# EAGLE design adp28 (EAGLE 6.2)
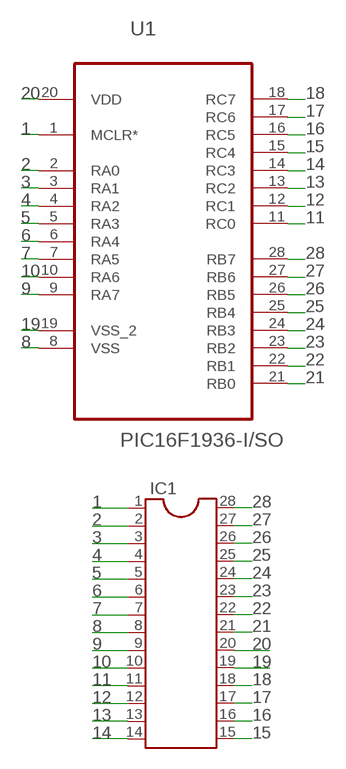
[diagram p0: schematic, sheet 1]

## Parts
IC1  DIL28  [DIL28-6]
U1  PIC16F1936-I/SO  [SOIC127P1030X265-28N]

## Nets
1: IC1.1 U1.1(MCLR*)
2: IC1.2 U1.2(RA0)
3: IC1.3 U1.3(RA1)
4: IC1.4 U1.4(RA2)
5: IC1.5 U1.5(RA3)
6: IC1.6 U1.6(RA4)
7: IC1.7 U1.7(RA5)
8: IC1.8 U1.8(VSS)
9: IC1.9 U1.9(RA7)
10: IC1.10 U1.10(RA6)
11: IC1.11 U1.11(RC0)
12: IC1.12 U1.12(RC1)
13: IC1.13 U1.13(RC2)
14: IC1.14 U1.14(RC3)
15: IC1.15 U1.15(RC4)
16: IC1.16 U1.16(RC5)
17: IC1.17 U1.17(RC6)
18: IC1.18 U1.18(RC7)
19: IC1.19 U1.19(VSS_2)
20: IC1.20 U1.20(VDD)
21: IC1.21 U1.21(RB0)
22: IC1.22 U1.22(RB1)
23: IC1.23 U1.23(RB2)
24: IC1.24 U1.24(RB3)
25: IC1.25 U1.25(RB4)
26: IC1.26 U1.26(RB5)
27: IC1.27 U1.27(RB6)
28: IC1.28 U1.28(RB7)

## Library data of the parts
IC1 = ic-package:DIL28: Dual In Line
U1 = pic16f1936 soic:PIC16F1936-I/SO: IC PIC MCU FLASH 512KX14 ,SOIC-28; MPN: PIC16F1936-I/SO; OC_FARNELL: 1755820; OC_NEWARK: 45P4764; PACKAGE: SOIC-28; SUPPLIER: Microchip

## Board
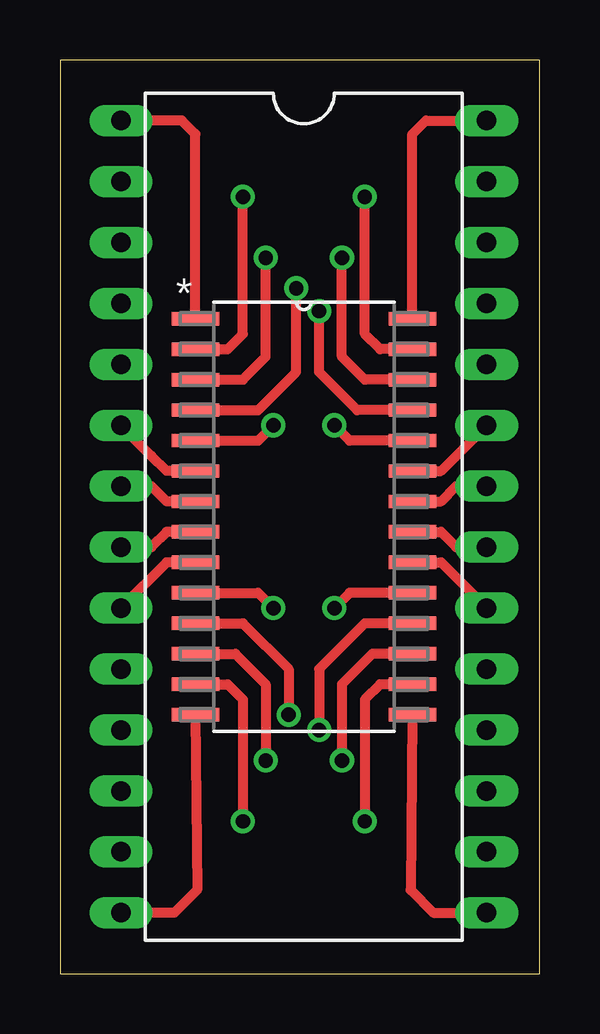
[diagram p1: board, top side]
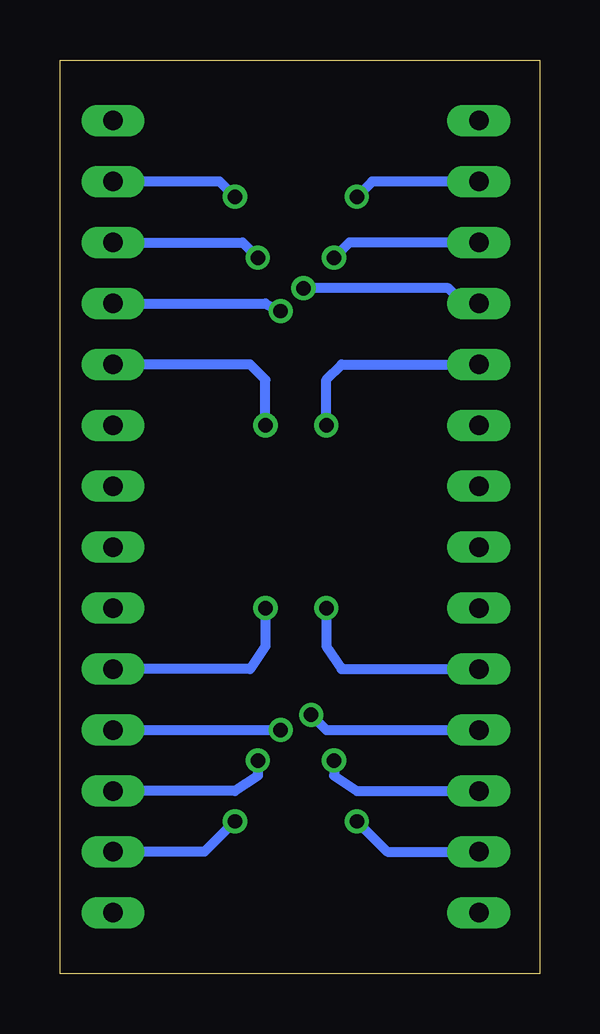
[diagram p2: board, bottom side, seen from below]

Size 19.99 x 38.09 mm. Coordinates in mm from the lower left corner, seen from the top.
Outline: 0,0 19.99,0 19.99,38.09 0,38.09 0,0
Copper layers (1*16): Top 0.035mm / dielectric 1.5mm / Bottom 0mil
Design rules: minimum track width 10mil, minimum drill 24mil, track to track 8mil, track to pad 8mil, pad to pad 8mil, via to via 8mil, smd to smd 8mil, copper to edge 40mil, drill to drill 8mil, minimum pad ring 10mil, minimum via ring 8mil, stop-mask expansion 4mil, vias tented up to drill 0mil, thermal gap 10mil

### Footprints (pad centres in the part's own frame; a part is rotated, then mirrored left to right if it is on the bottom)
DIL28-6 = drill 0.813 long: 1 -16.51,-7.62; 2 -13.97,-7.62; 3 -11.43,-7.62; 4 -8.89,-7.62; 5 -6.35,-7.62; 6 -3.81,-7.62; 7 -1.27,-7.62; 8 1.27,-7.62; 9 3.81,-7.62; 10 6.35,-7.62; 11 8.89,-7.62; 12 11.43,-7.62; 13 13.97,-7.62; 14 16.51,-7.62; 15 16.51,7.62; 16 13.97,7.62; 17 11.43,7.62; 18 8.89,7.62; 19 6.35,7.62; 20 3.81,7.62; 21 1.27,7.62; 22 -1.27,7.62; 23 -3.81,7.62; 24 -6.35,7.62; 25 -8.89,7.62; 26 -11.43,7.62; 27 -13.97,7.62; 28 -16.51,7.62
SOIC127P1030X265-28N = smd 1.981 x 0.559: 1 -4.521,8.255; 2 -4.521,6.985; 3 -4.521,5.715; 4 -4.521,4.445; 5 -4.521,3.175; 6 -4.521,1.905; 7 -4.521,0.635; 8 -4.521,-0.635; 9 -4.521,-1.905; 10 -4.521,-3.175; 11 -4.521,-4.445; 12 -4.521,-5.715; 13 -4.521,-6.985; 14 -4.521,-8.255; 15 4.521,-8.255; 16 4.521,-6.985; 17 4.521,-5.715; 18 4.521,-4.445; 19 4.521,-3.175; 20 4.521,-1.905; 21 4.521,-0.635; 22 4.521,0.635; 23 4.521,1.905; 24 4.521,3.175; 25 4.521,4.445; 26 4.521,5.715; 27 4.521,6.985; 28 4.521,8.255

### Placement (x,y rotation side)
IC1  10.16,19.05 270 top
U1  10.16,19.05 0 top

### Tracks (layer width: path | path; a pad name or v marks a point on that pad's centre or on a via)
1
  Top 0.406: U1.1 5.64,35 5.08,35.56 IC1.1
2  (via drill 0.6)
  Top 0.406: U1.2 6.99,26.04 7.62,26.67 v7.62,32.38
  Bottom 0.406: IC1.2 6.99,33.02 v7.62,32.38
3  (via drill 0.6)
  Top 0.406: U1.3 7.62,24.77 8.57,25.72 v8.57,29.84
  Bottom 0.406: IC1.3 7.94,30.48 v8.57,29.84
4  (via drill 0.6)
  Top 0.406: U1.4 8.26,23.5 9.84,25.08 v9.84,28.57
  Bottom 0.406: IC1.4 3.17,27.94 3.81,28.57 v9.84,28.57
5  (via drill 0.6)
  Top 0.406: U1.5 8.26,22.23 v8.89,22.86
  Bottom 0.406: v8.89,22.86 8.89,24.77 8.26,25.4 IC1.5
6
  Top 0.406: U1.6 4.45,20.95 3.81,21.59 IC1.6
7
  Top 0.406: U1.7 4.45,19.68 3.81,20.32 IC1.7
8
  Top 0.406: U1.8 4.45,18.41 3.81,17.78 IC1.8
9
  Top 0.406: U1.9 4.45,17.14 IC1.9
10  (via drill 0.6)
  Top 0.406: U1.10 8.26,15.88 v8.89,15.24
  Bottom 0.406: v8.89,15.24 8.89,13.65 8.26,12.7 IC1.10
11  (via drill 0.6)
  Top 0.406: U1.11 7.62,14.61 9.53,12.7 v9.53,10.79
  Bottom 0.406: v9.53,10.79 8.89,10.16 IC1.11
12  (via drill 0.6)
  Top 0.406: U1.12 7.3,13.34 8.57,12.06 v8.57,8.89
  Bottom 0.406: v8.57,8.89 8.57,8.26 7.62,7.62 IC1.12
13  (via drill 0.6)
  Top 0.406: U1.13 6.99,12.06 7.62,11.43 v7.62,6.35
  Bottom 0.406: v7.62,6.35 6.35,5.08 IC1.13
14
  Top 0.406: U1.14 5.71,3.49 4.76,2.54 IC1.14
15
  Top 0.406: U1.15 14.61,3.49 15.56,2.54 IC1.15
16  (via drill 0.6)
  Top 0.406: U1.16 13.34,12.06 12.7,11.43 v12.7,6.35
  Bottom 0.406: v12.7,6.35 13.97,5.08 IC1.16
17  (via drill 0.6)
  Top 0.406: U1.17 13.02,13.34 11.75,12.06 v11.75,8.89
  Bottom 0.406: v11.75,8.89 11.75,8.26 12.7,7.62 IC1.17
18  (via drill 0.6)
  Top 0.406: U1.18 12.7,14.61 10.79,12.7 v10.79,10.16
  Bottom 0.406: IC1.18 v10.79,10.16
19  (via drill 0.6)
  Top 0.406: U1.19 12.06,15.88 v11.43,15.24
  Bottom 0.406: v11.43,15.24 11.43,13.65 12.06,12.7 IC1.19
20
  Top 0.406: U1.20 15.88,17.14 IC1.20
21
  Top 0.406: U1.21 15.56,18.41 15.88,18.41 16.51,17.78 IC1.21
22
  Top 0.406: U1.22 15.56,19.68 15.88,19.68 16.51,20.32 IC1.22
23
  Top 0.406: U1.23 15.56,20.95 15.88,20.95 IC1.23
24  (via drill 0.6)
  Top 0.406: U1.24 12.06,22.23 v11.43,22.86
  Bottom 0.406: v11.43,22.86 11.43,24.77 12.06,25.4 IC1.24
25  (via drill 0.6)
  Top 0.406: U1.25 12.38,23.5 10.79,25.08 v10.79,27.62
  Bottom 0.406: IC1.25 11.43,27.94 v10.79,27.62
26  (via drill 0.6)
  Top 0.406: U1.26 12.7,24.77 11.75,25.72 v11.75,29.84
  Bottom 0.406: IC1.26 12.38,30.48 v11.75,29.84
27  (via drill 0.6)
  Top 0.406: U1.27 13.34,26.04 12.7,26.67 v12.7,32.38
  Bottom 0.406: v12.7,32.38 13.34,33.02 IC1.27
28
  Top 0.406: U1.28 14.68,35 15.24,35.56 IC1.28